# EAGLE design Dell_Supply_Hack_V1.3 (EAGLE 9.6.2)
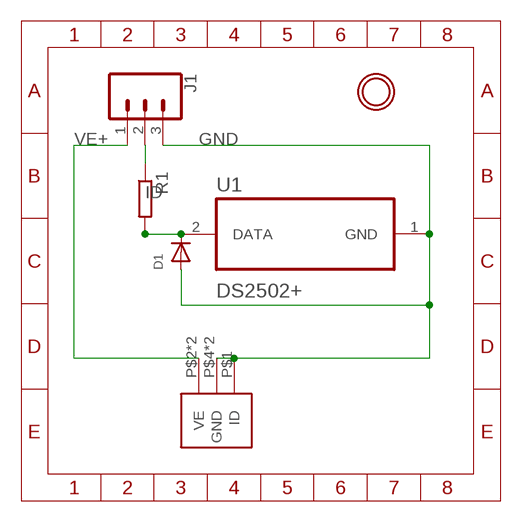
[diagram p0: schematic, sheet 1]

## Parts
D1  DIODESOD-323F  [SOD-323F]
J1  CONN_03LONGPADS  [1X03_LONGPADS]
R1  R-EU_R0603  [R0603]
U1  DS2502+  [TO92127P495H695-3]
U$1  DELL_CON  [DELL_CON_01]
U$2  MOUNTING_HOLE  [MOUNTINGHOLE_3.0_PLATED]

## Nets
GND: D1.A J1.3 U1.1(GND) U$1.P$1(ID) U$1.P$4(GND) U$1.P$5(GND)
ID: J1.2 R1.1
N$2: D1.C R1.2 U1.2(DATA)
VE+: J1.1 U$1.P$2(VE) U$1.P$3(VE)

## Library data of the parts
D1 = adafruit:DIODE: Diode SMADIODE - SMA Surface Mount Package 20V 1A Schottky Diode Digikey: 641-1014-6-ND DO-1N4148 - Through Hole Small Current Diode SOD-123 20V 1 A (.5mV Vf) Schottky Diode - Digikey: MBRX120TPMSCT-ND SOD-323 10V 570mA (.38mV Vf, 3ns) Schottky Diode - Digikey: ZLLS410CT-ND SOD-523 30V 30mA Schottky Diode (RB751S-40TE61) - Digikey: RB751S-40TE61CT-ND SOT23-R/W - SOT23 Package (R = Solder Paste/Reflow Ovens, W = Hand-Soldering) BAT54Film 40V 300mA - Digikey: 497-7162-1-ND
J1 = SparkFun-Connectors:CONN_03: Multi connection point. Often used as Generic Header-pin footprint for 0.1 inch spaced/style header connections On any of the 0.1 inch spaced packages, you can populate with these: Break Away Headers - Straight <https://www.sparkfun.com/products/116> (PRT-00116) Break Away Male Headers - Right Angle <https://www.sparkfun.com/products/553> (PRT-00553) Female Headers <https://www.sparkfun.com/products/115> (PRT-00115) Break Away Headers - Machine Pin <https://www.sparkfun.com/products/117> (PRT-00117) Break Away Female Headers - Swiss Machine Pin <https://www.sparkfun.com/products/743> (PRT-00743) Stackable Header - 3 Pin (Female, 0.1") <https://www.sparkfun.com/products/13875> (PRT-13875) For SCREWTERMINALS and SPRING TERMINALS visit here: Screw Terimnals on SparkFun.com <https://www.sparkfun.com/search/results?term=Screw+Terminals> (5mm/3.5mm/2.54mm spacing) This device is also useful as a general connection point to wire up your design to another part of your project. Our various solder wires solder well into these plated through hole pads. Hook-Up Wire - Assortment (Stranded, 22 AWG) <https://www.sparkfun.com/products/11375> (PRT-11375) Hook-Up Wire - Assortment (Solid Core, 22 AWG) <https://www.sparkfun.com/products/11367> (PRT-11367) View the entire wire category on our website here <https://www.sparkfun.com/categories/141> Special notes: Molex polarized connector foot print use with SKU : PRT-08232 with associated crimp pins and housings.
R1 = rcl:R-EU_: RESISTOR, European symbol; SPICEPREFIX: R
U1 = DS2502_:DS2502+: None Check prices <https://pricing.snapeda.com/parts/DS2502/Maxim%20Integrated/view-part?ref=eda>; AVAILABILITY: In Stock; DESCRIPTION: EPROM - OTP Memory IC 1Kb (128 x 8) 1-Wire® SOT-23-3; MF: Maxim Integrated; MP: DS2502; PACKAGE: TO-226-3 Maxim; PRICE: None
U$1 = Bat-Components:DELL_CON
U$2 = Bat-Components:MOUNTING_HOLE

## Board
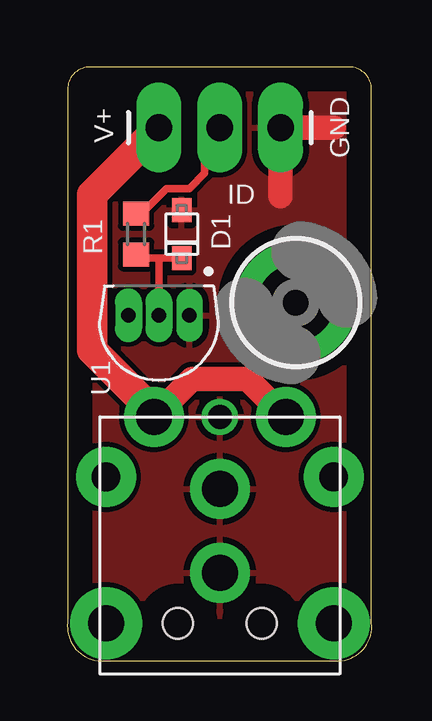
[diagram p1: board, top side]
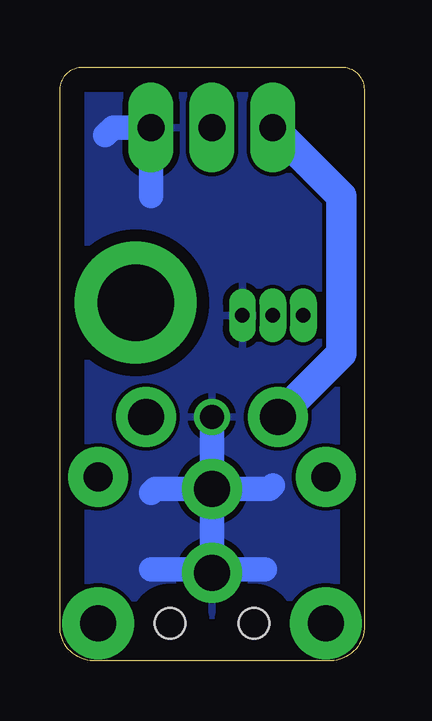
[diagram p2: board, bottom side, seen from below]

Size 12.7 x 24.75 mm. Coordinates in mm from the lower left corner, seen from the top.
Outline: 0.01,23.81 0.01,1.59 arc90 1.28,0 11.44,0 arc90 12.69,1.57 12.69,23.81 arc90 11.75,24.75 0.95,24.75 arc90 0.01,23.81
Copper layers (1*16): Top 0.035mm / dielectric 1.5mm / Bottom 0.035mm
Design rules "default": minimum track width 6mil, minimum drill 0.35mm, track to track 6mil, track to pad 6mil, pad to pad 6mil, via to via 6mil, smd to smd 6mil, copper to edge 40mil, drill to drill 6mil, minimum pad ring 10mil, minimum via ring 8mil, stop-mask expansion 4mil, vias tented up to drill 0mil, thermal gap 10mil

### Footprints (pad centres in the part's own frame; a part is rotated, then mirrored left to right if it is on the bottom)
SOD-323F = smd 1 x 0.8: A -1,0; C 1,0
1X03_LONGPADS = drill 1.118 pad 1.88 long: 1 0,0; 2 2.54,0; 3 5.08,0
R0603 = smd 1 x 1.1: 1 -0.85,0; 2 0.85,0
TO92127P495H695-3 = drill 0.6 long: 1 -1.27,-0.745 | drill 0.6 pad 1.12 long: 2 0,-0.745; 3 1.27,-0.745
DELL_CON_01 = drill 1: P$1 0,0 | drill 1.5 pad 2.5: P$2 2.75,0; P$3 -2.75,0; P$4 0,3; P$5 0,6.5 | drill 1.2 pad 2.5: P$6 4.75,2.5; P$7 -4.75,2.5 | drill 1.5 pad 3: P$8 -4.75,8.6; P$9 4.75,8.6 | hole 1.27: -1.75,8.6; 1.75,8.6
MOUNTINGHOLE_3.0_PLATED = drill 3.2 pad 5.08: P$1 0,0

### Placement (x,y rotation side)
D1  4.77,17.78 270 top
J1  3.82,22.23 0 top
R1  2.87,17.78 270 top
U1  3.82,13.65 180 top
U$1  6.36,10.16 180 top
U$2  9.53,14.92 0 top

### Tracks (layer width: path | path; a pad name or v marks a point on that pad's centre or on a via)
GND
  Top 1.016: 8.9,19.37 J1.3 11.12,22.23
  Bottom 1.016: 10.8,21.91 10.49,22.23 J1.3 8.9,19.37 | U$1.P$4 U$1.P$5 | U$1.P$5 6.21,3.81 4.14,3.81 | U$1.P$5 6.51,3.81 8.9,3.81 | U$1.P$4 8.72,7.16 8.9,6.99 | U$1.P$4 U$1.P$1 | U$1.P$4 3.96,7.16 3.82,7.3
  pour Top (isolate 0.203): -2.53,26.67 13.98,26.67 13.98,-5.08 -2.53,-5.08
  pour Bottom: -1.26,25.4 13.98,25.4 13.98,-3.81 -1.26,-3.81
ID
  Top 0.305: J1.2 5.72,21.59 5.72,20.32 5.09,19.69 4.14,19.69 2.74,18.29 R1.1
N$2
  Top 0.305: D1.C 3.82,16.78 | 3.82,16.78 3.02,16.78 R1.2 | U1.2 3.82,16.78
VE+
  Top 1.016: U$1.P$2 5.2,11.75 7.52,11.75 U$1.P$3
  Top 1.27: J1.1 1.02,19.43 1.02,12.95 3.82,10.16
  Bottom 1.27: U$1.P$2 0.96,12.81 0.96,19.37 J1.1

### Text on the board
tPlace: V+ | GND | ID